# Altium schematic sheet ZX-XH2.54-2PZZ1_ZX-XH2.54-2PZZ.schdoc
size 124 x 99 mm
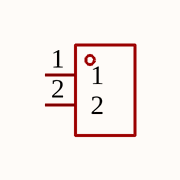
[diagram p0: ZX-XH2.54-2PZZ1_ZX-XH2.54-2PZZ.schdoc]

## Parts
CN?  ZX-XH2.54-2PZZ  [CONN-TH_2P-P2.50_HX25003-2A]  (value not drawn)

## Nets

Not connected (* = marked no-connect by the designer): CN? 1 2

## Library data of the parts
CN? = ZX-XH2.54-2PZZ: Manufacturer: Megastar(兆星); Add into BOM: yes; Pins Structure: 1x2P; Pitch: 2.54mm; Reference Series: XH; Number of PINs Per Row: 2; Current Rating (Max): 3A; Symbol: ZX-XH2.54-2PZZ; Device: ZX-XH2.54-2PZZ; LCSC Part Name: ZX-XH2.54-2PZZ; Supplier Part: C7429632; Manufacturer Part: ZX-XH2.54-2PZZ; Supplier Footprint: 插件,P=2.54mm; JLCPCB Part Class: Extended Part; Datasheet: https://atta.szlcsc.com/upload/public/pdf/source/20230619/19BA6947230AA44A04D3EDD65E618FD0.pdf; Supplier: LCSC; Convert to PCB: yes; Mounting Style: 直插; Number of Pins: 2P; Number of Rows: 1; Row Spacing: -; Contact Material: 黄铜; Contact Plating: 锡; Operating Temperature Range: -25℃~+85℃